# Altium schematic sheet NCE7560K1_NCE7560K.schdoc
size 127 x 101 mm
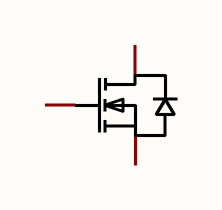
[diagram p0: NCE7560K1_NCE7560K.schdoc]

## Parts
Q?  NCE7560K  [TO-252-2_L6.6-W6.1-P4.57-LS9.9-TL-CW]  (value not drawn)

## Nets

Not connected (* = marked no-connect by the designer): Q? 1(G) 2(D) 3(S)

## Library data of the parts
Q? = NCE7560K: Manufacturer: NCE(无锡新洁能); Add into BOM: yes; Type: N沟道; Drain Source Voltage (Vdss): 75V; Continuous Drain Current (Id): 60A; Power Dissipation (Pd): 140W; Drain Source On Resistance (RDS(on)@Vgs,Id): 8.5mΩ@10V,30A; Gate Threshold Voltage (Vgs(th)@Id): 4V@250uA; Name: NCE7560K; Symbol: NCE7560K; Device: NCE7560K; LCSC Part Name: N沟道 75V 60A; Supplier Part: C95273; Manufacturer Part: NCE7560K; Supplier Footprint: TO-252-2(DPAK); JLCPCB Part Class: Extended Part; Datasheet: https://atta.szlcsc.com/upload/public/pdf/source/20170211/1486785673842.pdf; Supplier: LCSC; Convert to PCB: yes